# EAGLE schematic ABL_RP2040 (EAGLE 9.6.2)
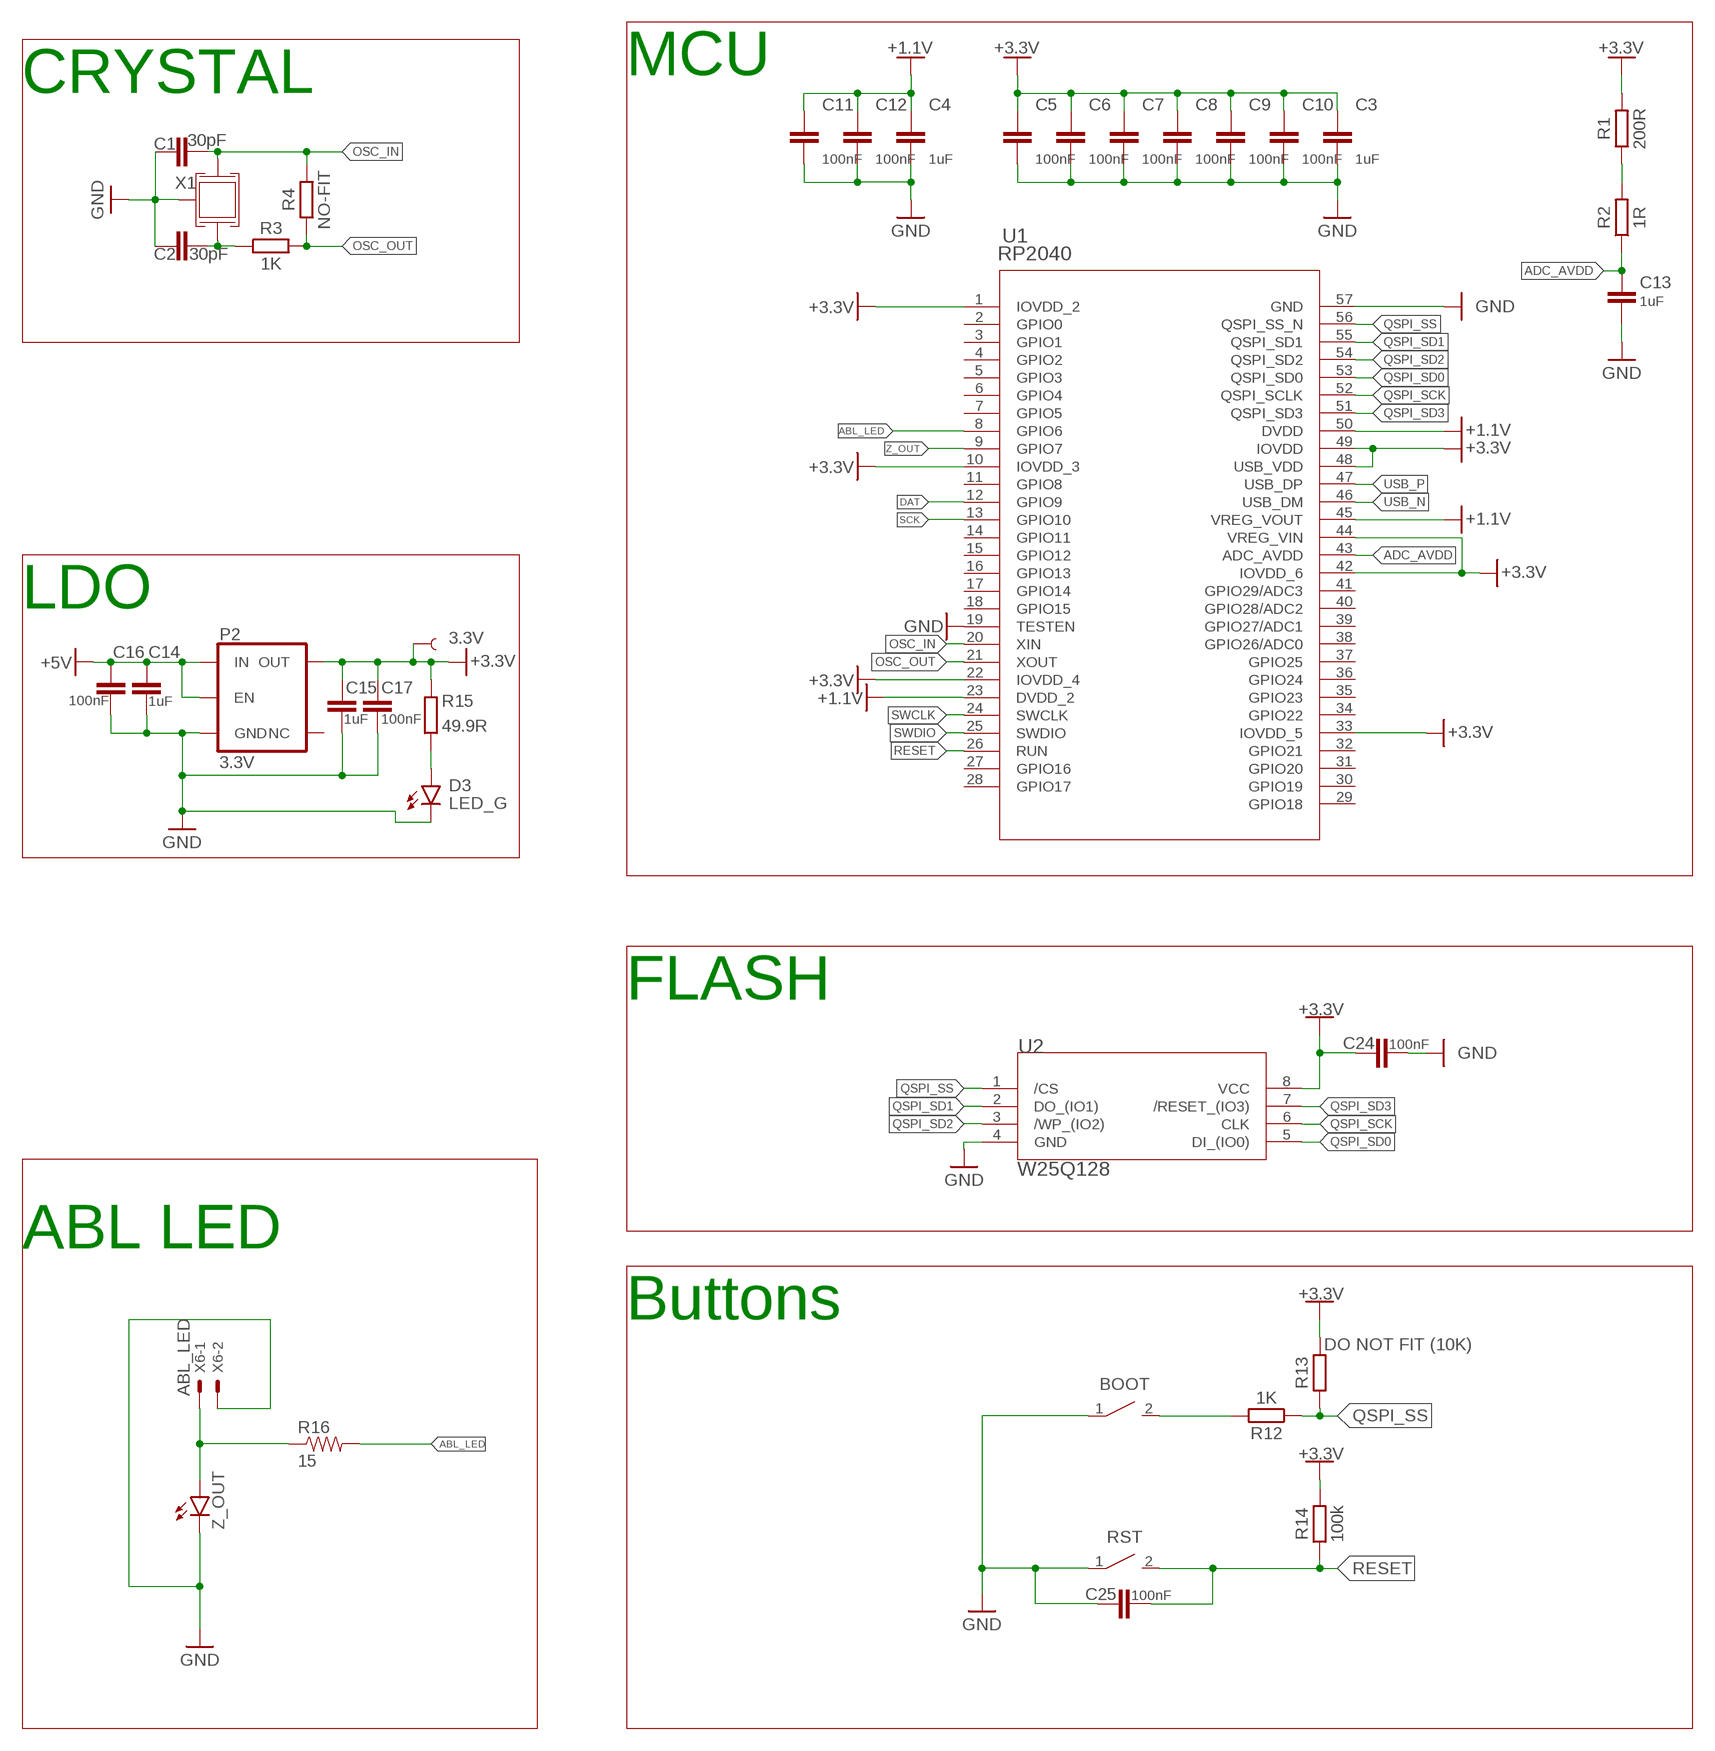
[diagram p0: schematic, sheet 1, part 1 of 2]
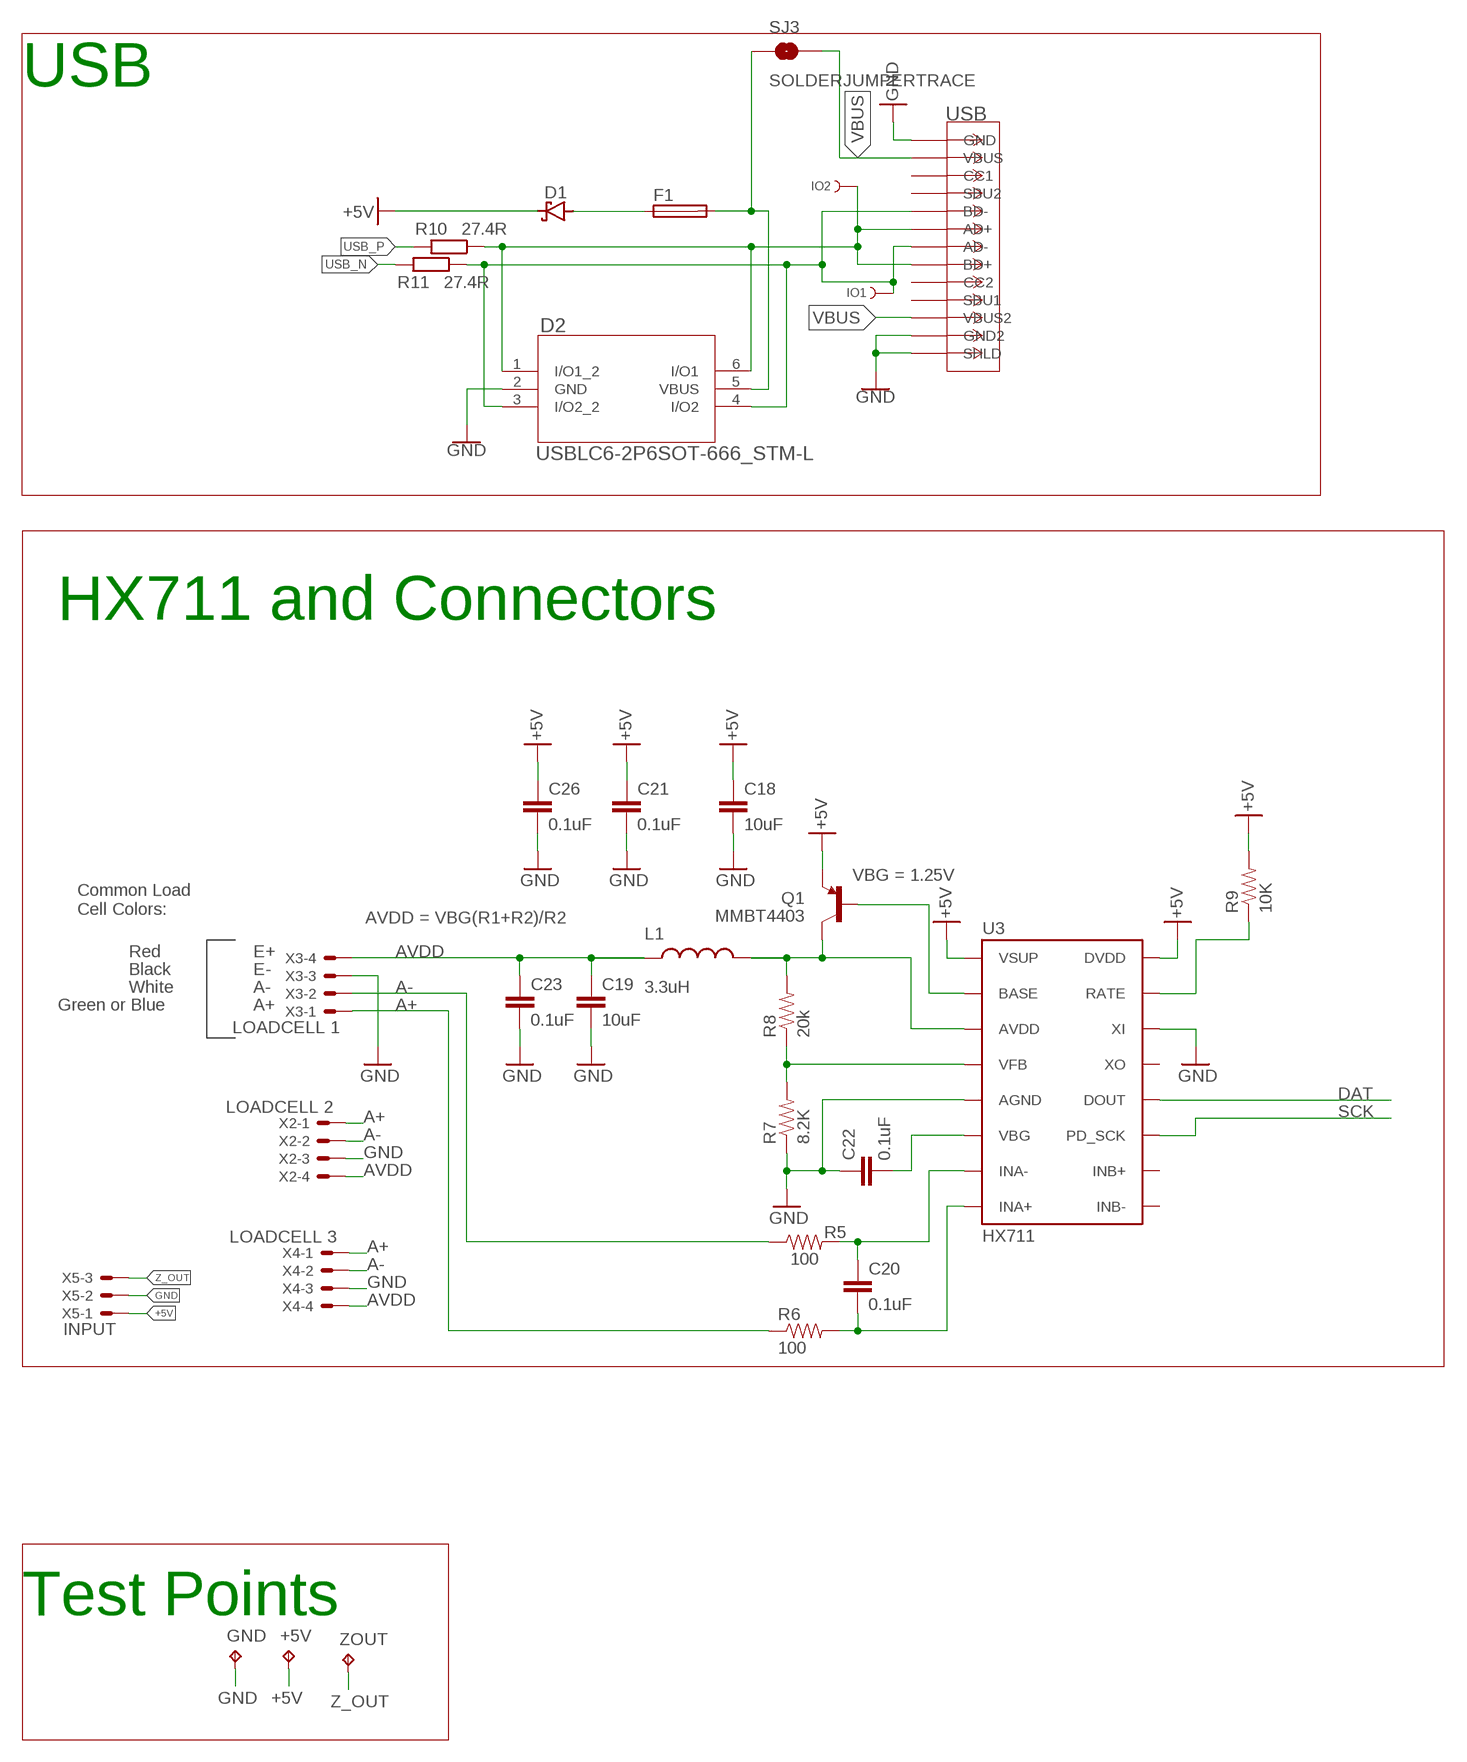
[diagram p1: schematic, sheet 1, part 2 of 2]

## Parts
3.3V  TEST-POINT3X4  [PAD.03X.04]
+5V  TPB2,54  [B2,54]
BOOT  B3U-1000P(M)-B  B3U-X000B3U-1000P(M)-B1000P(M)-B  [B3U-1000P(M)-B]
C1  30pF  C_CHIP-0402(1005-METRIC)  [CAPC1005X60]
C2  30pF  C_CHIP-0402(1005-METRIC)  [CAPC1005X60]
C3  1uF  C_CHIP-0402(1005-METRIC)  [CAPC1005X60]
C4  1uF  C_CHIP-0402(1005-METRIC)  [CAPC1005X60]
C5  100nF  C_CHIP-0402(1005-METRIC)  [CAPC1005X60]
C6  100nF  C_CHIP-0402(1005-METRIC)  [CAPC1005X60]
C7  100nF  C_CHIP-0402(1005-METRIC)  [CAPC1005X60]
C8  100nF  C_CHIP-0402(1005-METRIC)  [CAPC1005X60]
C9  100nF  C_CHIP-0402(1005-METRIC)  [CAPC1005X60]
C10  100nF  C_CHIP-0402(1005-METRIC)  [CAPC1005X60]
C11  100nF  C_CHIP-0402(1005-METRIC)  [CAPC1005X60]
C12  100nF  C_CHIP-0402(1005-METRIC)  [CAPC1005X60]
C13  1uF  C_CHIP-0402(1005-METRIC)  [CAPC1005X60]
C14  1uF  C_CHIP-0402(1005-METRIC)  [CAPC1005X60]
C15  1uF  C_CHIP-0402(1005-METRIC)  [CAPC1005X60]
C16  100nF  C_CHIP-0402(1005-METRIC)  [CAPC1005X60]
C17  100nF  C_CHIP-0402(1005-METRIC)  [CAPC1005X60]
C18  10uF  10UF50V20%(1210)  [1210]
C19  10uF  10UF50V20%(1210)  [1210]
C20  0.1uF  0.1UF-25V-5%(0603)  [0603-CAP]
C21  0.1uF  0.1UF-25V-5%(0603)  [0603-CAP]
C22  0.1uF  0.1UF-25V-5%(0603)  [0603-CAP]
C23  0.1uF  0.1UF-25V-5%(0603)  [0603-CAP]
C24  100nF  C_CHIP-0402(1005-METRIC)  [CAPC1005X60]
C25  100nF  C_CHIP-0402(1005-METRIC)  [CAPC1005X60]
C26  0.1uF  0.1UF-25V-5%(0603)  [0603-CAP]
D1  MBR0520LT1G  SCHOTTKY_MBR0520LT1GDO-219  [SODFL3718X115]
D2  USBLC6-2P6SOT-666_STM-L  [SOT-666_STM-L]
D3  LED_G  CHIP-FLAT-G_0603-0.35MM  [LEDC1608X35N_FLAT-G]
F1  FUSE_CHIP-0603(1608-METRIC)  [FUSC1608X60N]
GND  TPB2,54  [B2,54]
IO1  TEST-POINT3  [PAD.03X.03]
IO2  TEST-POINT3  [PAD.03X.03]
L1  3.3uH  INDUCTOR0805-IND  [0805]
P2  3.3V  V_REG_AP2112K-3.3V  [SOT23-5]
Q1  MMBT4403  TRANSISTOR_PNPMMBT4403  [SOT23-3]
R1  200R  R_CHIP-0402(1005-METRIC)  [RESC1005X40]
R2  1R  R_CHIP-0402(1005-METRIC)  [RESC1005X40]
R3  1K  R_CHIP-0402(1005-METRIC)  [RESC1005X40]
R4  NO-FIT  R_CHIP-0402(1005-METRIC)  [RESC1005X40]
R5  100  100OHM-1/10W-1%(0603)  [0603-RES@1]
R6  100  100OHM-1/10W-1%(0603)  [0603-RES@1]
R7  8.2K  8.2KOHM-1/10W-5%(0603)  [0603-RES]
R8  20k  20KOHM1/10W1%(0603)  [0603-RES]
R9  10K  10KOHM-1/10W-1%(0603)0603  [0603-RES@1]
R10  27.4R  R_CHIP-0402(1005-METRIC)  [RESC1005X40]
R11  27.4R  R_CHIP-0402(1005-METRIC)  [RESC1005X40]
R12  1K  R_CHIP-0402(1005-METRIC)  [RESC1005X40]
R13  DO NOT FIT (10K)  R_CHIP-0402(1005-METRIC)  [RESC1005X40]
R14  100k  R_CHIP-0402(1005-METRIC)  [RESC1005X40]
R15  49.9R  R_CHIP-0402(1005-METRIC)  [RESC1005X40]
R16  15  RESISTOR0603  [0603-RES]
RST  B3U-1000P(M)-B  B3U-X000B3U-1000P(M)-B1000P(M)-B  [B3U-1000P(M)-B]
SJ3  SOLDERJUMPERTRACE  [SJ_2S-TRACE]
U1  RP2040  RP2040IC57_RP2040-L  [IC57_RP2040-L]
U2  W25Q128  W25Q128JVSIQSOIC_128JVSIQ_WIN-L  [SOIC_128JVSIQ_WIN-L]
U3  HX711  HX711HX711  [SO16]
USB  USB-C(KH-TYPE-C-16P)  [CONN12_KH-TYPE-C-16P]
X1  CRYSTAL_TAXM12M4RLBDDT2T_3225  [CRYSTAL_3225]
X2  LOADCELL 2  JST-XH-04-PIN-LONG-PAD  [JST-XH-04-PACKAGE-LONG-PAD]
X3  LOADCELL 1  JST-XH-04-PIN-LONG-PAD  [JST-XH-04-PACKAGE-LONG-PAD]
X4  LOADCELL 3  JST-XH-04-PIN-LONG-PAD  [JST-XH-04-PACKAGE-LONG-PAD]
X5  INPUT  JST-XH-03-PIN-LONG-PAD  [JST-XH-03-PACKAGE-LONG-PAD]
X6  ABL_LED  JST-XH-02-PIN-LONG-PAD  [JST-XH-02-PACKAGE-LONG-PAD]
Z_OUT  LEDSML0603  [SML0603]
ZOUT  TPB2,54  [B2,54]

## Nets
+1.1V [POWER]: C4.1 C11.1 C12.1 U1.23(DVDD_2) U1.45(VREG_VOUT) U1.50(DVDD)
+3.3V [POWER]: 3.3V.P$1 C3.1 C5.1 C6.1 C7.1 C8.1 C9.1 C10.1 C15.1 C17.1 C24.1 P2.5(OUT) R1.2 R13.2 R14.2 R15.2 U1.1(IOVDD_2) U1.10(IOVDD_3) U1.22(IOVDD_4) U1.33(IOVDD_5) U1.42(IOVDD_6) U1.44(VREG_VIN) U1.48(USB_VDD) U1.49(IOVDD) U2.8(VCC)
+5V [POWER]: +5V.TP C14.1 C16.1 C18.1 C21.1 C26.1 D1.1(C) P2.1(IN) P2.3(EN) Q1.2(E) R9.2 U3.1(VSUP) U3.16(DVDD) X5.1
A+: R6.1 X2.1 X3.1 X4.1
A-: R5.1 X2.2 X3.2 X4.2
ABL_LED: R16.2 U1.8(GPIO6)
ADC_AVDD: C13.1 R2.1 U1.43(ADC_AVDD)
ADC_R: R1.1 R2.2
AVDD: C19.1 C23.1 L1.1 X2.4 X3.4 X4.4
DAT: U1.12(GPIO9) U3.12(DOUT)
GND [POWER]: BOOT.1 C1.2 C2.1 C3.2 C4.2 C5.2 C6.2 C7.2 C8.2 C9.2 C10.2 C11.2 C12.2 C13.2 C14.2 C15.2 C16.2 C17.2 C18.2 C19.2 C21.2 C22.1 C23.2 C24.2 C25.1 C26.2 D2.2(GND) D3.C GND.TP P2.2(GND) R7.1 RST.1 U1.19(TESTEN) U1.57(GND) U2.4(GND) U3.5(AGND) U3.14(XI) USB.1(GND) USB.12(GND2) USB.13(SHLD) USB.14(SHLD) USB.15(SHLD) USB.16(SHLD) USB.18(SHLD) USB.19(SHLD) USB.20(SHLD) USB.21(SHLD) USB.24(SHLD) USB.25(SHLD) USB.26(SHLD) USB.27(SHLD) USB.28(SHLD) USB.29(SHLD) USB.37(SHLD) USB.39(SHLD) USB.41(SHLD) USB.43(SHLD) X1.P$2(GND) X1.P$4(GND) X2.3 X3.3 X4.3 X5.2 X6.2 Z_OUT.C
LDOLED: D3.A R15.1
N$1: R9.1 U3.15(RATE)
N$2: C20.1 R5.2 U3.7(INA-)
N$3: C20.2 R6.2 U3.8(INA+)
N$4: Q1.1(B) U3.2(BASE)
N$5: L1.2 Q1.3(C) R8.2 U3.3(AVDD)
N$6: R7.2 R8.1 U3.4(VFB)
N$7: C22.2 U3.6(VBG)
N$8: R16.1 X6.1 Z_OUT.A
OSC_IN: C1.1 R4.2 U1.20(XIN) X1.P$1(P1)
OSC_OUT: R3.2 R4.1 U1.21(XOUT)
QSPI_SCK: U1.52(QSPI_SCLK) U2.6(CLK)
QSPI_SD0: U1.53(QSPI_SD0) U2.5(DI_(IO0))
QSPI_SD1: U1.55(QSPI_SD1) U2.2(DO_(IO1))
QSPI_SD2: U1.54(QSPI_SD2) U2.3(/WP_(IO2))
QSPI_SD3: U1.51(QSPI_SD3) U2.7(/RESET_(IO3))
QSPI_SS: R12.1 R13.1 U1.56(QSPI_SS_N) U2.1(/CS)
RESET: C25.2 R14.1 RST.2 U1.26(RUN)
SCK: U1.13(GPIO10) U3.11(PD_SCK)
SWB: BOOT.2 R12.2
SWCLK: U1.24(SWCLK)
SWDIO: U1.25(SWDIO)
USB1_N [DIFF]: D2.3(I/O2_2) D2.4(I/O2) IO1.P$1 R11.1 USB.5(BD-) USB.7(AD-)
USB1_P [DIFF]: D2.1(I/O1_2) D2.6(I/O1) IO2.P$1 R10.1 USB.6(AD+) USB.8(BD+)
USB_N [DIFF]: R11.2 U1.46(USB_DM)
USB_P [DIFF]: R10.2 U1.47(USB_DP)
VBUS [POWER]: SJ3.2 USB.2(VBUS) USB.11(VBUS2)
VBUS1 [POWER]: D2.5(VBUS) F1.2 SJ3.1
VBUS3 [POWER]: D1.2(A) F1.1
XR: C2.2 R3.1 X1.P$3(P2)
Z_OUT: U1.9(GPIO7) X5.3 ZOUT.TP
Unconnected: P2.4(NC) U1.2(GPIO0) U1.3(GPIO1) U1.4(GPIO2) U1.5(GPIO3) U1.6(GPIO4) U1.7(GPIO5) U1.11(GPIO8) U1.14(GPIO11) U1.15(GPIO12) U1.16(GPIO13) U1.17(GPIO14) U1.18(GPIO15) U1.27(GPIO16) U1.28(GPIO17) U1.29(GPIO18) U1.30(GPIO19) U1.31(GPIO20) U1.32(GPIO21) U1.34(GPIO22) U1.35(GPIO23) U1.36(GPIO24) U1.37(GPIO25) U1.38(GPIO26/ADC0) U1.39(GPIO27/ADC1) U1.40(GPIO28/ADC2) U1.41(GPIO29/ADC3) U3.9(INB-) U3.10(INB+) U3.13(XO) USB.3(CC1) USB.4(SBU2) USB.9(CC2) USB.10(SBU1)

## Notes on the sheet
- CRYSTAL | MCU | USB
- LDO | HX711 and Connectors
- VBG = 1.25V
- Common Load
  Cell Colors:
- AVDD = VBG(R1+R2)/R2
- Red | E+
- Black | E-
- White | A-
- FLASH | Green or Blue | A+
- ABL LED
- Buttons
- Test Points

## Library data of the parts
3.3V IO1 IO2 = SparkFun-Connectors:TEST-POINT: SparkFun Test Points Bare copper test points for troubleshooting or In-Circuit-Testing. These are used by our Production team for verifying production board runs using pogo-pins on test beds. SparkFun Products: SparkFun LSM9DS1 Breakout <https://www.sparkfun.com/products/13284> SparkFun PSOC <https://www.sparkfun.com/products/13714> SparkFun Load Cell Amplifier <https://www.sparkfun.com/products/13879>
+5V GND ZOUT = testpad:TP: Test pad
BOOT RST = Switch:B3U-X000: Ultra-small Tactile Switch Contact form : SPST-NO Datasheet <https://omronfs.omron.com/en_US/ecb/products/pdf/en-b3u.pdf>; CATEGORY: SWITCH; DESCRIPTION: Ultra-small Surface-mounting Tactile Switches with High Contact Reliability; LCSCPN#: C231329; MANUFACTURER: OMRON; OPERATING_TEMPERATURE: -25°C to +70°C at 60%RH max; PART_STATUS: ACTIVE; SERIES: B3U; TYPE: Tactile
C1 C2 = Fracktal Misc Lib:C: Capacitor - Generic; CATEGORY: Capacitor; LCSCPN#: C1570
C3 C4 C13-C15 = Fracktal Misc Lib:C: Capacitor - Generic; CATEGORY: Capacitor; LCSCPN#: C52923
C5-C12 C16 C17 C24 C25 = Fracktal Misc Lib:C: Capacitor - Generic; CATEGORY: Capacitor; LCSCPN#: C307331
C18 C19 = SparkFun-Capacitors:10UF50V20%(1210): CAP-09824; PROD_ID: CAP-09824
C20-C23 C26 = SparkFun-Capacitors:0.1UF-25V-5%(0603): CAP-08604; PROD_ID: CAP-08604
D1 = Diode:SCHOTTKY_: Schottky Diode - Popular parts; CATEGORY: Diode; DESCRIPTION: DIODE SCHOTTKY 20V 500MA SOD123; MANUFACTURER: ON Semiconductor; MPN: MBR0520LT1G; SUB-CATEGORY: Schottky
D2 = 2023-04-02_04-17-07_Library:USBLC6-2P6; COPYRIGHT: Copyright (C) 2023 Ultra Librarian. All rights reserved.; LCSCPN#: C2827693; MANUFACTURER_PART_NUMBER: USBLC6-2P6; MFR_NAME: STMicroelectronics
D3 = LED:CHIP-FLAT-G; CATEGORY: LED; COLOR: GREEN; DESCRIPTION: CHIP LED FLAT; LCSCPN#: C72043; SUB-CATEGORY: CHIP; TYPE: FLAT_TOP; VALUE: LED_GREEN
F1 = Circuit-Protection:FUSE: Fuse - Generic; CATEGORY: Circuit-Protection; LCSCPN#: C261937; SUB-CATEGORY: Fuse
L1 = SparkFun-Passives:INDUCTOR: Inductors Basic Inductor/Choke - 0603 and 1206. Footprints are not proven and vary greatly between part numbers. INDUCTOR POWER 3.3UH 4.0A SMD 0.197" L x 0.197" W x 0.177" H (5.00mm x 5.00mm x 4.50mm); PROD_ID: NDUC-13076
P2 = SparkFun-IC-Power:V_REG_AP2112: AP2112 - 600mA CMOS LDO Regulator w/ Enable The AP2112 is CMOS process low dropout linear regulator with enable function, the regulator delivers a guaranteed 600mA (min.) continuous load current. Features Output Voltage Accuracy: ±1.5% Output Current: 600mA (Min.) Foldback Short Current Protection: 50mA Enable Function to Turn ON/OFF VOUT Low Dropout Voltage (3.3V): 250mV (Typ.) @IOUT=600mA Excellent Load Regulation: 0.2%/A (Typ.) Excellent Line Regulation: 0.02%/V (Typ.) Low Quiescent Current: 55μA (Typ.) Low Standby Current: 0.01μA (Typ.) Low Output Noise: 50μVRMS PSRR: 100Hz -65dB, 1kHz -65dB OTSD Protection Stable with 1.0μF Flexible Cap: Ceramic, Tantalum and Aluminum Electrolytic Operation Temperature Range: -40°C to 85°C ESD: MM 400V, HBM 4000V; LCSCPN#: C51118; PROD_ID: VREG-12457
Q1 = SparkFun-DiscreteSemi:TRANSISTOR_PNP: Generic PNP BJT Double check pinouts against datasheets- not all devices are the same! MMBT3906 - 40V 200mA SOT-23 (TRANS-08052) MMBT4403 - 40V 600mA SOT-23 (TRANS-09245); PROD_ID: TRANS-09245
R1 = Fracktal Misc Lib:R: Resistor Fixed - Generic; CATEGORY: Resistor; LCSCPN#: C25087; SUB-CATEGORY: Fixed
R2 = Fracktal Misc Lib:R: Resistor Fixed - Generic; CATEGORY: Resistor; LCSCPN#: C25086; SUB-CATEGORY: Fixed
R3 R12 = Fracktal Misc Lib:R: Resistor Fixed - Generic; CATEGORY: Resistor; LCSCPN#: C25543; SUB-CATEGORY: Fixed
R4 R13 = Fracktal Misc Lib:R: Resistor Fixed - Generic; CATEGORY: Resistor; LCSCPN#: NO-FIT; SUB-CATEGORY: Fixed
R5 R6 = SparkFun-Resistors:100OHM-1/10W-1%(0603): RES-07863; PROD_ID: RES-07863
R7 = SparkFun-Resistors:8.2KOHM-1/10W-5%(0603): RES-10646; PROD_ID: RES-10646
R8 = SparkFun-Resistors:20KOHM1/10W1%(0603): RES-09383; PROD_ID: RES-09383
R9 = SparkFun-Resistors:10KOHM-1/10W-1%(0603): RES-00824; PROD_ID: RES-00824
R10 R11 = Fracktal Misc Lib:R: Resistor Fixed - Generic; CATEGORY: Resistor; LCSCPN#: C31439; SUB-CATEGORY: Fixed
R14 = Fracktal Misc Lib:R: Resistor Fixed - Generic; CATEGORY: Resistor; LCSCPN#: C25741; SUB-CATEGORY: Fixed
R15 = Fracktal Misc Lib:R: Resistor Fixed - Generic; CATEGORY: Resistor; LCSCPN#: C25120; SUB-CATEGORY: Fixed
R16 = SparkFun-Resistors:RESISTOR: Resistor Basic schematic elements and footprints for 0603, 1206, and PTH resistors.
SJ3 = SparkFun-Retired:SOLDERJUMPER: Solder Jumper Standard SMD solder jumper. Used to automate production. Two varients : Normally Open and Normally Closed are the same, but have different paste layers. NC will have a large amount of paste and should jumper during reflow.
U1 = 2023-03-26_17-59-48_Library:RP2040; COPYRIGHT: Copyright (C) 2023 Ultra Librarian. All rights reserved.; LCSCPN#: C2040; MANUFACTURER_PART_NUMBER: RP2040; MFR_NAME: Raspberry Pi
U2 = Fracktal Misc Lib:W25Q128JVSIQ; COPYRIGHT: Copyright (C) 2023 Ultra Librarian. All rights reserved.; LCSCPN#: C97521; MANUFACTURER_PART_NUMBER: W25Q128JVSIQ; MFR_NAME: Winbond
U3 = Testing:HX711; PROD_ID: IC-12445
USB = Fracktal Misc Lib:USB-C(KH-TYPE-C-16P): Shenzhen Kinghelm Elec KH-TYPE-C-16P LCSCPN# C709357; DATASHEET: https://datasheet.lcsc.com/lcsc/2009111434_Shenzhen-Kinghelm-Elec-KH-TYPE-C-16P_C709357.pdf; LCSCPN#: C709357; VENDOR: LCSC
X1 = Fracktal Misc Lib:CRYSTAL_TAXM12M4RLBDDT2T_3225; LCSCPN#: C133334
X2-X4 = Rembrandt Electronics - JST XH Connectors v1-0:JST-XH-04-PIN: JST XH Connector 2 Pin Wire to board connector. Pitch: 2,54 mm, (0.100") Number of pins: 4 Created by Rembrandt Electronics www.rembrandtelectronics.com
X5 = Rembrandt Electronics - JST XH Connectors v1-0:JST-XH-03-PIN: JST XH Connector 2 Pin Wire to board connector. Pitch: 2,54 mm, (0.100") Number of pins: 3 Created by Rembrandt Electronics www.rembrandtelectronics.com
X6 = Rembrandt Electronics - JST XH Connectors v1-0:JST-XH-02-PIN: JST XH Connector 2 Pin Wire to board connector. Pitch: 2,54 mm, (0.100") Number of pins: 2 Created by Rembrandt Electronics www.rembrandtelectronics.com
Z_OUT = led:LED: LED OSRAM: - CHIPLED LG R971, LG N971, LY N971, LG Q971, LY Q971, LO R971, LY R971 LH N974, LH R974 LS Q976, LO Q976, LY Q976 LO Q996 - Hyper CHIPLED LW Q18S LB Q993, LB Q99A, LB R99A - SideLED LS A670, LO A670, LY A670, LG A670, LP A670 LB A673, LV A673, LT A673, LW A673 LH A674 LY A675 LS A676, LA A676, LO A676, LY A676, LW A676 LS A679, LY A679, LG A679 - Hyper Micro SIDELED® LS Y876, LA Y876, LO Y876, LY Y876 LT Y87S - SmartLED LW L88C, LW L88S LB L89C, LB L89S, LG L890 LS L89K, LO L89K, LY L89K LS L896, LA L896, LO L896, LY L896 - TOPLED LS T670, LO T670, LY T670, LG T670, LP T670 LSG T670, LSP T670, LSY T670, LOP T670, LYG T670 LG T671, LOG T671, LSG T671 LB T673, LV T673, LT T673, LW T673 LH T674 LS T676, LA T676, LO T676, LY T676, LB T676, LH T676, LSB T676, LW T676 LB T67C, LV T67C, LT T67C, LS T67K, LO T67K, LY T67K, LW E67C LS E67B, LA E67B, LO E67B, LY E67B, LB E67C, LV E67C, LT E67C LW T67C LS T679, LY T679, LG T679 LS T770, LO T770, LY T770, LG T770, LP T770 LB T773, LV T773, LT T773, LW T773 LH T774 LS E675, LA E675, LY E675, LS T675 LS T776, LA T776, LO T776, LY T776, LB T776 LHGB T686 LT T68C, LB T68C - Hyper Mini TOPLED® LB M676 - Mini TOPLED Santana® LG M470 LS M47K, LO M47K, LY M47K Source: http://www.osram.convergy.de LUXEON: - LUMILED® LXK2-PW12-R00, LXK2-PW12-S00, LXK2-PW14-U00, LXK2-PW14-V00 LXK2-PM12-R00, LXK2-PM12-S00, LXK2-PM14-U00 LXK2-PE12-Q00, LXK2-PE12-R00, LXK2-PE12-S00, LXK2-PE14-T00, LXK2-PE14-U00 LXK2-PB12-K00, LXK2-PB12-L00, LXK2-PB12-M00, LXK2-PB14-N00, LXK2-PB14-P00, LXK2-PB14-Q00 LXK2-PR12-L00, LXK2-PR12-M00, LXK2-PR14-Q00, LXK2-PR14-R00 LXK2-PD12-Q00, LXK2-PD12-R00, LXK2-PD12-S00 LXK2-PH12-R00, LXK2-PH12-S00 LXK2-PL12-P00, LXK2-PL12-Q00, LXK2-PL12-R00 Source: www.luxeon.com KINGBRIGHT: KA-3528ASYC Source: www.kingbright.com